# EAGLE design rf exca (EAGLE 9.0.1)
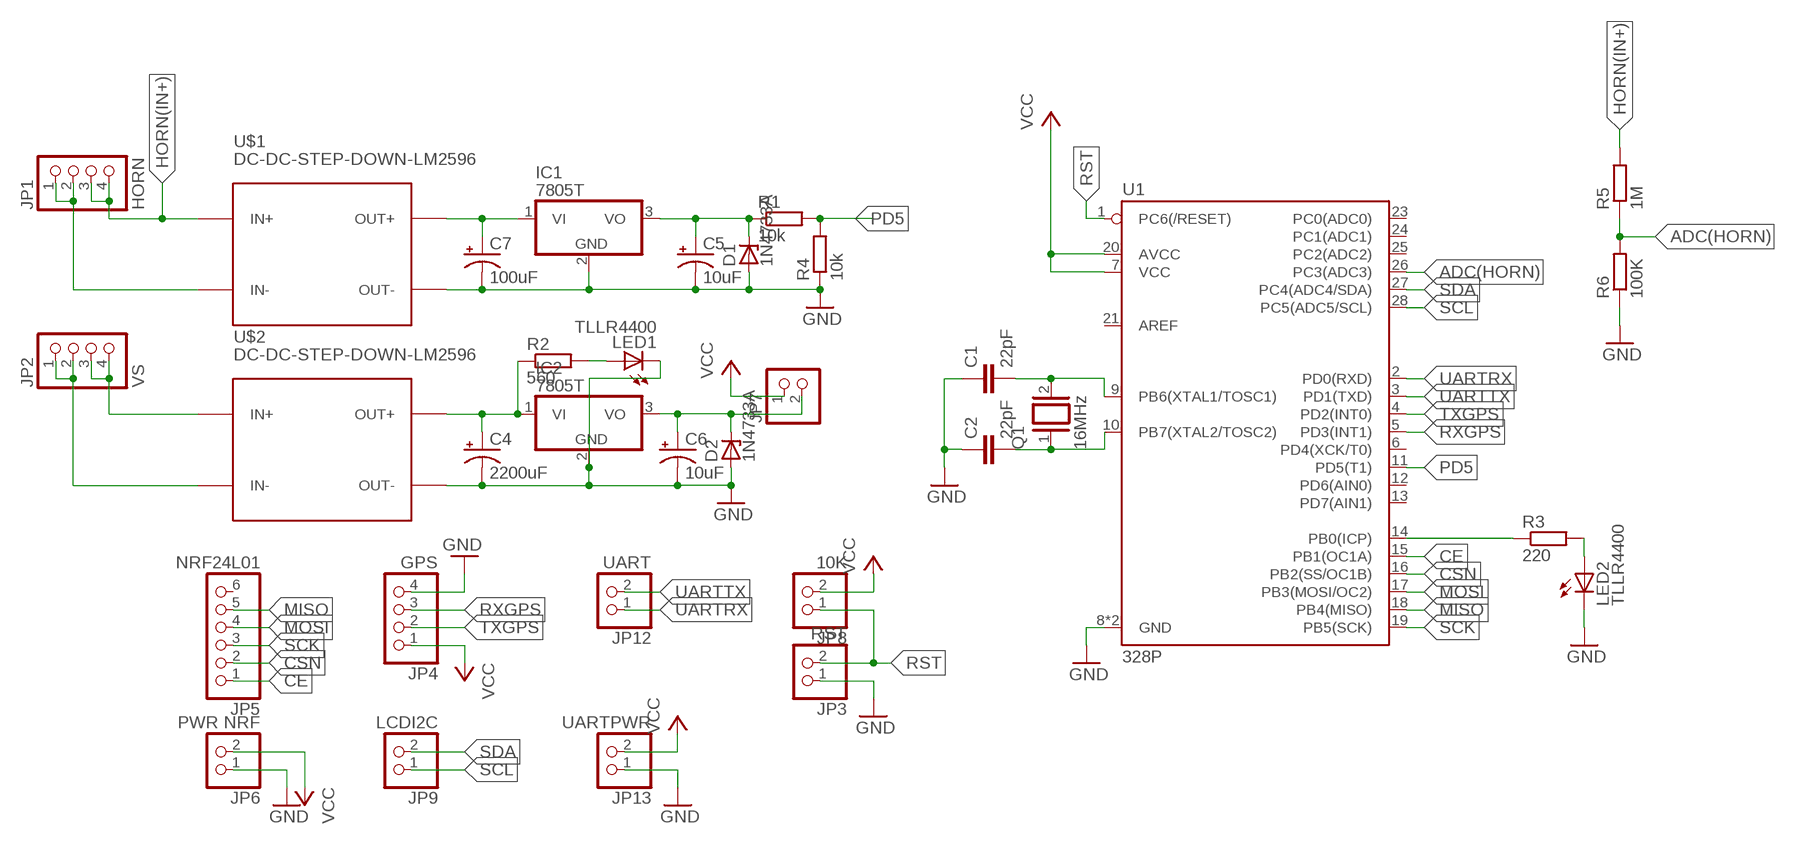
[diagram p0: schematic, sheet 1]

## Parts
C1  22pF  C-EU025-024X044  [C025-024X044]
C2  22pF  C-EU025-024X044  [C025-024X044]
C4  2200uF  CPOL-USE5-13  [E5-13]
C5  10uF  CPOL-USE2,5-6E  [E2,5-6E]
C6  10uF  CPOL-USE2,5-6E  [E2,5-6E]
C7  100uF  CPOL-USE2.5-7  [E2,5-7]
D1  1N4733A  1N4728  [DO41Z10]
D2  1N4733A  1N4728  [DO41Z10]
IC1  7805T  [TO220H]
IC2  7805T  [TO220H]
JP1  HORN  PINHD-1X4  [1X04]
JP2  VS  PINHD-1X4  [1X04]
JP3  RST  PINHD-1X2  [1X02]
JP4  GPS  PINHD-1X4  [1X04]
JP5  NRF24L01  PINHD-1X6  [1X06]
JP6  PWR NRF  PINHD-1X2  [1X02]
JP7  PINHD-1X2  [1X02]
JP8  10K  PINHD-1X2  [1X02]
JP9  LCDI2C  PINHD-1X2  [1X02]
JP12  UART  PINHD-1X2  [1X02]
JP13  UARTPWR  PINHD-1X2  [1X02]
LED1  TLLR4400  [LED3MM]
LED2  TLLR4400  [LED3MM]
Q1  16MHz  XTAL/S  [QS]
R1  10k  R-EU_0207/12  [0207/12]
R2  560  R-EU_0207/12  [0207/12]
R3  220  R-EU_0207/12  [0207/12]
R4  10k  R-EU_0207/12  [0207/12]
R5  1M  R-EU_0207/12  [0207/12]
R6  100K  R-EU_0207/12  [0207/12]
U1  328P  ATMEGA328P_PDIP  [DIP28]
U$1  DC-DC-STEP-DOWN-LM2596  [DC-DC-STEP-DOWN-LM2596]
U$2  DC-DC-STEP-DOWN-LM2596  [DC-DC-STEP-DOWN-LM2596]

## Nets
ADC(HORN): R5.1 R6.2 U1.26(PC3(ADC3))
CE: JP5.1 U1.15(PB1(OC1A))
CSN: JP5.2 U1.16(PB2(SS/OC1B))
GND: C1.1 C2.1 C4.- C5.- C6.- C7.- D1.A D2.A IC1.2(GND) IC2.2(GND) JP3.1 JP4.4 JP6.1 JP13.1 LED1.K(C) LED2.K(C) R4.1 R6.1 U1.8(GND) U1.22(GND) U$1.OUT- U$2.OUT-
HORN(IN+): JP1.3 JP1.4 R5.2 U$1.IN+
MISO: JP5.5 U1.18(PB4(MISO))
MOSI: JP5.4 U1.17(PB3(MOSI/OC2))
N$1: C1.2 Q1.2 U1.9(PB6(XTAL1/TOSC1))
N$2: C2.2 Q1.1 U1.10(PB7(XTAL2/TOSC2))
N$4: JP1.1 JP1.2 U$1.IN-
N$5: JP2.3 JP2.4 U$2.IN+
N$6: JP2.1 JP2.2 U$2.IN-
N$8: LED2.A R3.2
N$9: LED1.A R2.2
N$10: C7.+ IC1.1(VI) U$1.OUT+
N$11: C6.+ D2.C IC2.3(VO) JP7.2
N$12: C5.+ D1.C IC1.3(VO) R1.1
N$14: R3.1 U1.14(PB0(ICP))
N$15: C4.+ IC2.1(VI) R2.1 U$2.OUT+
PD5: R1.2 R4.2 U1.11(PD5(T1))
RST: JP3.2 JP8.1 U1.1(PC6(/RESET))
RXGPS: JP4.3 U1.5(PD3(INT1))
SCK: JP5.3 U1.19(PB5(SCK))
SCL: JP9.1 U1.28(PC5(ADC5/SCL))
SDA: JP9.2 U1.27(PC4(ADC4/SDA))
TXGPS: JP4.2 U1.4(PD2(INT0))
UARTRX: JP12.1 U1.2(PD0(RXD))
UARTTX: JP12.2 U1.3(PD1(TXD))
VCC: JP4.1 JP6.2 JP7.1 JP8.2 JP13.2 U1.7(VCC) U1.20(AVCC)
Unconnected: JP5.6 U1.6(PD4(XCK/T0)) U1.12(PD6(AIN0)) U1.13(PD7(AIN1)) U1.21(AREF) U1.23(PC0(ADC0)) U1.24(PC1(ADC1)) U1.25(PC2(ADC2))

## Library data of the parts
C1 C2 = rcl:C-EU: CAPACITOR, European symbol; SPICEPREFIX: C
C4-C7 = rcl:CPOL-US: POLARIZED CAPACITOR, American symbol; SPICEPREFIX: C
D1 D2 = diode:1N4728: Z DIODE 3.3 V, 1W, 5 percent
IC1 IC2 = linear:78*: Positive VOLTAGE REGULATOR Source: http://cache.national.com/ds/LM/LM78L05.pdf http://www.fairchildsemi.com/ds/LM/LM7805.pdf
JP1 JP2 JP4 = pinhead:PINHD-1X4: PIN HEADER
JP3 JP6-JP9 JP12 JP13 = pinhead:PINHD-1X2: PIN HEADER
JP5 = pinhead:PINHD-1X6: PIN HEADER
LED1 LED2 = led:TLLR4400: Low Current (2mA) LED 3 mm Tinted Diffused Package color RED Source: Data sheet <http://www.farnell.com/datasheets/391100.pdf>; MF: VISHAY SEMICONDUCTOR; OC_FARNELL: 1612437
Q1 = special:XTAL/S: CRYSTAL
R1-R6 = rcl:R-EU_: RESISTOR, European symbol; SPICEPREFIX: R
U1 = SparkFun-IC-Microcontroller:ATMEGA328P_PDIP: Atmel 328P Through hole ATMEGA328P uC used in the Arduino 32kb flash, 1k EEPROM, 2k SRAM Datasheet <http://www.sparkfun.com/datasheets/Components/SMD/ATMega328.pdf> SparkFun Products Storefront component: AVR 28 Pin 20MHz 32K 6A/D - ATMega328P <https://www.sparkfun.com/products/9061> (COM-09061) SparkFun Simon Says - Through-Hole Soldering Kit <https://www.sparkfun.com/products/10547> (KIT-10547) SparkFun Learn to Solder - Simon Says <https://www.sparkfun.com/products/13708> (KIT-13708) SparkFun BigTime Watch Kit <https://www.sparkfun.com/products/11734> (KIT-11734) SparkFun ClockIt <https://www.sparkfun.com/products/10930> (KIT-10930) SparkFun Serial Enabled LCD Kit <https://www.sparkfun.com/products/10097> (LCD-10097) SparkFun Simon Tilts - Through Hole Soldering Kit <https://www.sparkfun.com/products/12634> (KIT-12634) SparkFun Frequency Counter Kit <https://www.sparkfun.com/products/10140> (KIT-10140) FabFM Radio Kit <https://www.sparkfun.com/products/11043> (KIT-11043) SparkFun Binary Blaster Kit <https://www.sparkfun.com/products/12037> (KIT-12037) SparkFun Metro-Gnome <https://www.sparkfun.com/products/9236> (KIT-09236) ATmega328 with Arduino Optiboot (Uno) <https://www.sparkfun.com/products/10524> (DEV-10524); PROD_ID: IC-09136
U$1 U$2 = diy-modules:DC-DC-STEP-DOWN-LM2596: DC/DC Step-Down Regulator based on LM2596-ADJ chip LM2596 datasheet available here: http://www.ti.com/lit/ds/symlink/lm2596.pdf Click here to find device on ebay.com <http://www.ebay.com/sch/lm2596+power+regulator>

## Board
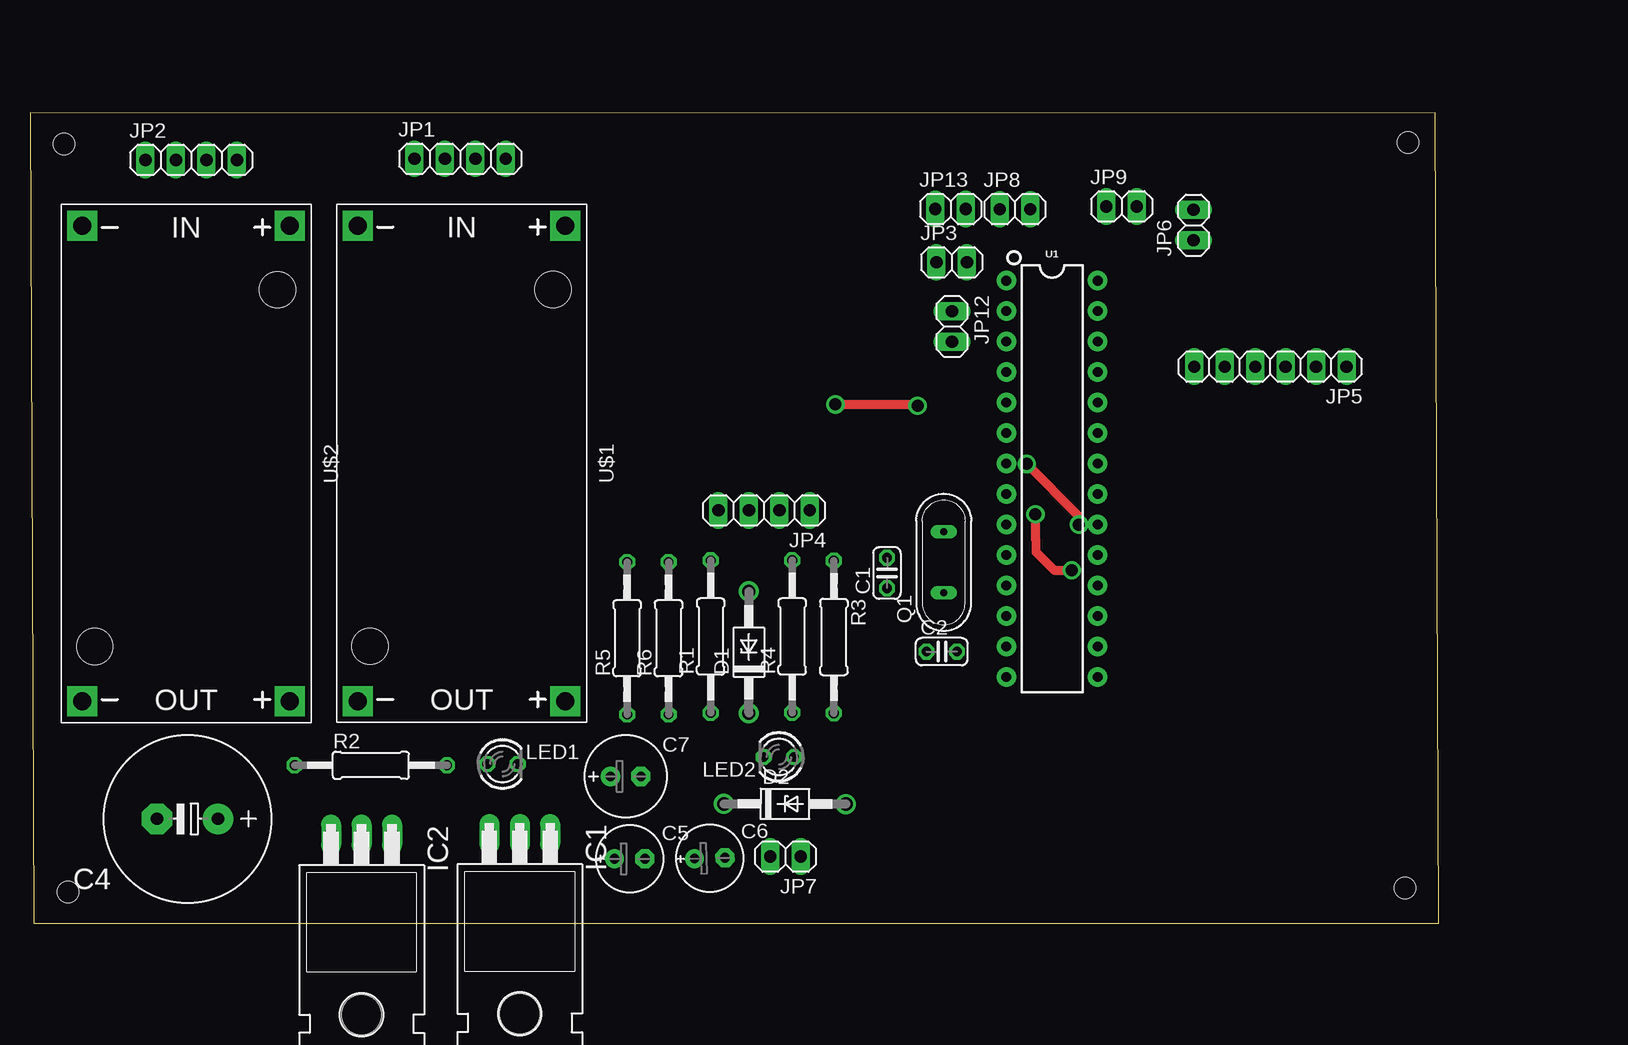
[diagram p1: board, top side]
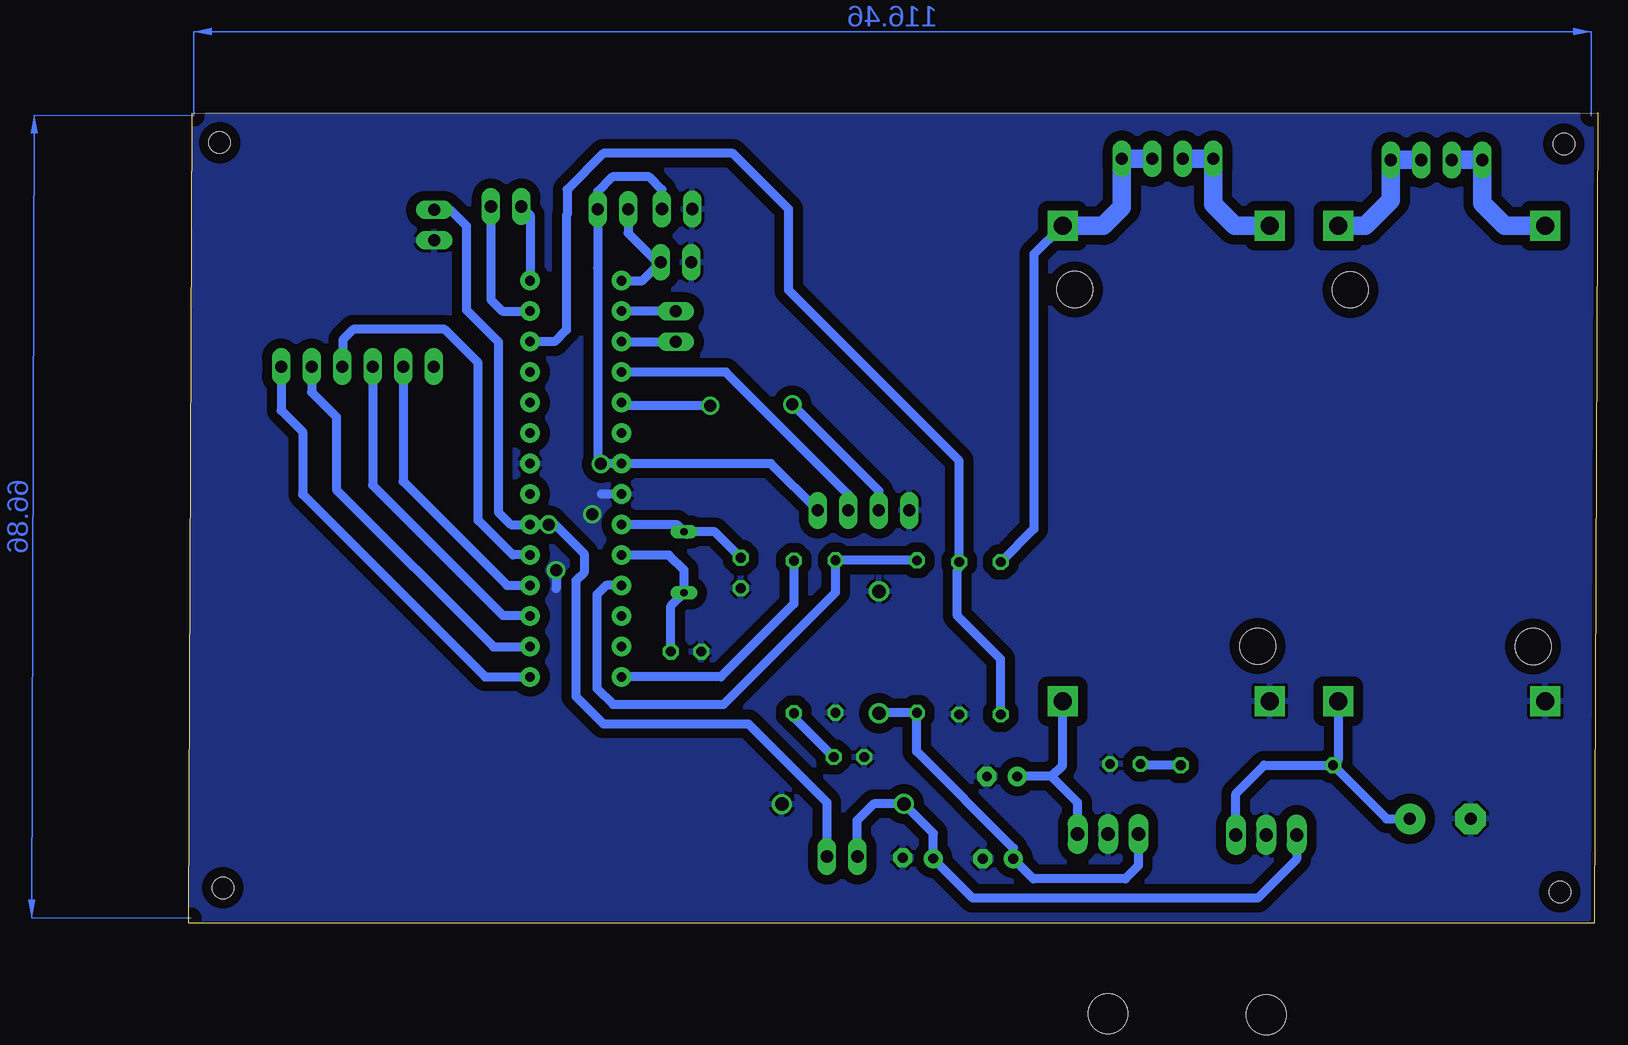
[diagram p2: board, bottom side, seen from below]

Size 117.41 x 67.54 mm. Coordinates in mm from the lower left corner, seen from the top.
Outline: 0.29,0.03 117.41,0 117.12,67.51 0,67.54 0.29,0.03
Copper layers (1*16): Top 0.035mm / dielectric 1.5mm / Bottom 0.035mm
Design rules "default *": minimum track width 30mil, minimum drill 1mm, track to track 8mil, track to pad 8mil, pad to pad 8mil, via to via 8mil, smd to smd 8mil, copper to edge 0mil, drill to drill 6mil, minimum pad ring 10mil, minimum via ring 8mil, stop-mask expansion 4mil, vias tented up to drill 0mil, thermal gap 10mil
Holes 1.78 mm at 3.15,2.63 114.58,2.97 2.82,64.94 114.85,65.06

### Footprints (pad centres in the part's own frame; a part is rotated, then mirrored left to right if it is on the bottom)
C025-024X044 = drill 0.813 octagon: 1 -1.27,0; 2 1.27,0
E5-13 = drill 1.016 pad 2.54: + -2.54,0 | drill 1.016 pad 2.54 octagon: - 2.54,0
E2,5-6E = drill 0.813 pad 1.575: + -1.27,0 | drill 0.813 pad 1.575 octagon: - 1.27,0
E2,5-7 = drill 0.813 pad 1.6: + -1.27,0 | drill 0.813 pad 1.6 octagon: - 1.27,0
DO41Z10 = drill 1.118: A 5.08,0; C -5.08,0
TO220H = drill 1.118 long: 1 -2.54,-10.16; 2 0,-10.16; 3 2.54,-10.16 | hole 3.302: 0,4.826
1X04 = drill 1.016 long: 1 -3.81,0; 2 -1.27,0; 3 1.27,0; 4 3.81,0
1X02 = drill 1.016 long: 1 -1.27,0; 2 1.27,0
1X06 = drill 1.016 long: 1 -6.35,0; 2 -3.81,0; 3 -1.27,0; 4 1.27,0; 5 3.81,0; 6 6.35,0
LED3MM = drill 0.813 octagon: A -1.27,0; K 1.27,0
QS = drill 0.61 long: 1 -2.54,0; 2 2.54,0
0207/12 = drill 0.813 octagon: 1 -6.35,0; 2 6.35,0
DIP28 = drill 0.813 pad 1.626: 1 -16.51,-3.81; 2 -13.97,-3.81; 3 -11.43,-3.81; 4 -8.89,-3.81; 5 -6.35,-3.81; 6 -3.81,-3.81; 7 -1.27,-3.81; 8 1.27,-3.81; 9 3.81,-3.81; 10 6.35,-3.81; 11 8.89,-3.81; 12 11.43,-3.81; 13 13.97,-3.81; 14 16.51,-3.81; 15 16.51,3.81; 16 13.97,3.81; 17 11.43,3.81; 18 8.89,3.81; 19 6.35,3.81; 20 3.81,3.81; 21 1.27,3.81; 22 -1.27,3.81; 23 -3.81,3.81; 24 -6.35,3.81; 25 -8.89,3.81; 26 -11.43,3.81; 27 -13.97,3.81; 28 -16.51,3.81
DC-DC-STEP-DOWN-LM2596 = drill 1.5 pad 2.5 square: IN+ -19.812,8.636; IN- -19.812,-8.636; OUT+ 19.812,8.636; OUT- 19.812,-8.636 | hole 3: -14.478,7.62; 15.24,-7.62

### Placement (x,y rotation side)
C1  71.42,29.2 90 top
C2  75.97,22.65 0 top
C4  13.13,8.72 180 top
C5  49.97,5.38 0 top
C6  56.64,5.44 1.7 top
C7  49.64,12.25 0 top
D1  59.9,22.59 90 top
D2  62.91,9.95 359.9 top
IC1  40.81,-2.7 180 top
IC2  27.63,-2.78 180 top
JP1  35.85,63.72 0 top
JP2  13.43,63.62 0 top
JP3  76.81,55.09 0 top
JP4  61.18,34.41 180 top
JP5  103.36,46.4 180 top
JP6  96.96,58.19 90 top
JP7  62.96,5.57 180 top
JP8  82.08,59.51 0 top
JP9  90.97,59.75 0 top
JP12  76.83,49.73 270 top
JP13  76.72,59.53 0 top
LED1  39.37,13.29 0 top
LED2  62.41,13.86 180 top
Q1  76.14,30.09 90 top
R1  56.73,23.9 90 top
R2  28.4,13.17 0 top
R3  66.99,23.87 270 top
R4  63.52,23.91 90 top
R5  49.76,23.76 90 top
R6  53.22,23.76 90 top
U1  85.17,37.05 270 top
U$1  35.96,38.34 270 top
U$2  13,38.32 270 top

### Tracks (layer width: path | path; a pad name or v marks a point on that pad's centre or on a via)
ADC(HORN)
  Bottom 0.762: R5.1 49.76,22.02 53.37,25.63 53.37,29.47 53.22,29.62 R6.2 53.22,38.55 67.43,52.77 67.43,59.52 72.08,64.17 82.86,64.17 85.88,61.14 85.88,59.07 85.96,58.99 85.96,49.45 86.93,48.48 U1.26
CE
  Bottom 0.762: JP5.1 109.71,42.76 107.93,40.98 107.93,35.76 92.72,20.54 U1.15
CSN
  Bottom 0.762: JP5.2 107.17,44.28 105.11,42.21 105.11,36.15 92.01,23.05 89.01,23.05 U1.16
GND  (via drill 1 pad 1.52)
  Top 0.762: v83.78,34.09 83.78,31.99 83.82,31.96 83.82,30.95 85.34,29.43 v86.81,29.43
  Bottom 0.762: U1.8 83.02,35.78 | v86.81,29.43 86.81,27.89
  pour Bottom (isolate 0.813): 0.54,67.29 117,67.29 116.86,61.46 117.24,0.43 0.78,0.43
HORN(IN+)
  Bottom 0.762: U$1.IN+ 46.99,55.76 46.99,32.88 R5.2
  Bottom 1.524: JP1.3 JP1.4 39.66,59.67 41.21,58.12 44.56,58.12 U$1.IN+
MISO
  Bottom 0.762: JP5.5 99.55,36.83 90.88,28.16 U1.18
MOSI
  Bottom 0.762: JP5.4 102.09,36.52 91.25,25.67 89.03,25.67 U1.17
N$1
  Bottom 0.762: U1.9 76.75,33.24 Q1.2 | 75.91,32.4 Q1.2 | C1.2 73.58,32.63 Q1.2
N$2
  Bottom 0.762: U1.10 81.34,30.69 77.4,30.69 76.14,29.43 Q1.1 77.24,26.45 C2.2
N$4
  Bottom 1.524: JP1.2 JP1.1 32.04,59.93 30.25,58.14 27.34,58.14 U$1.IN-
N$5
  Bottom 1.524: JP2.3 JP2.4 17.24,60.42 17.24,60.26 19.37,58.13 U$2.IN+
N$6
  Bottom 1.524: JP2.2 JP2.1 9.62,60 7.75,58.13 U$2.IN-
N$8
  Bottom 0.762: LED2.A 66.99,17.17 R3.2
N$9
  Bottom 0.762: R2.2 37.99,13.17 LED1.A
N$10
  Bottom 0.762: IC1.1 43.35,10.07 45.53,12.25 | 45.53,12.25 C7.+ | 45.53,12.25 44.6,13.17 U$1.OUT+
N$11
  Bottom 0.762: IC2.3 25.09,5.35 28.34,2.1 52.08,2.1 C6.+ 55.37,7.51 D2.C 60.35,9.96 61.74,8.57 61.74,5.61 JP7.2
N$12
  Bottom 0.762: IC1.3 38.27,4.81 39.37,3.72 47.04,3.72 C5.+ 48.7,6.27 56.76,14.32 56.76,17.51 R1.1 59.86,17.55 D1.C
N$14
  Bottom 0.762: R3.1 66.99,26.63 73.08,20.54 U1.14
N$15
  Bottom 0.762: U$2.OUT+ 21.64,13.59 R2.1 | R2.1 17.6,8.72 C4.+ | IC2.1 30.17,10.81 27.8,13.18 R2.1
PD5
  Bottom 0.762: 63.51,30.25 R4.2 | R1.2 63.51,30.25 | U1.11 82.64,28.16 83.4,27.4 83.4,19.59 82.06,18.24 72.85,18.24 63.51,27.58 63.51,30.25
RST
  Bottom 0.762: U1.1 79.61,53.56 JP3.2 78.37,55.09 80.8,57.52 JP8.1 80.74,58.88
RXGPS  (via drill 1 pad 1.52)
  Top 0.762: v67.11,43.24 73.86,43.24 v73.96,43.13
  Bottom 0.762: JP4.3 59.91,36.04 v67.11,43.24 | v73.96,43.13 81.09,43.13 U1.5
SCK
  Bottom 0.762: U1.19 90.42,30.7 93.3,33.58 93.3,46.71 96.09,49.5 103.7,49.5 104.57,48.63 104.57,46.46 JP5.3
SCL
  Bottom 0.762: JP9.1 88.98,59.03 U1.28
SDA
  Bottom 0.762: JP9.2 92.24,51.99 91.28,51.03 88.99,51.03 U1.27
TXGPS
  Bottom 0.762: JP4.2 62.45,35.74 72.65,45.94 U1.4
UARTRX
  Bottom 0.762: JP12.1 81.34,51 U1.2
UARTTX
  Bottom 0.762: U1.3 76.84,48.48 JP12.2
VCC  (via drill 1 pad 1.52)
  Top 0.762: v83.07,38.29 87.42,33.94 v87.42,33.23
  Bottom 0.762: 83.04,38.32 U1.7 68.9,38.32 JP4.1 | 83.04,38.32 v83.07,38.29 | 88.97,33.23 v87.42,33.23 86.89,33.23 84.47,30.81 84.47,29.24 85.15,28.55 85.15,18.92 82.86,16.63 70.79,16.63 64.24,10.08 JP7.1 | 88.97,33.23 U1.20 | 83.34,54.61 83.34,38.63 83.04,38.32 | 83.34,54.61 JP8.2 83.34,60.98 82.12,62.21 79.05,62.21 77.99,61.15 JP13.2 | 83.34,54.61 | JP6.2 95.64,59.46 94.29,58.12 94.29,51.12 91.63,48.46 91.63,34.27 90.58,33.23 88.97,33.23
(copper drawn outside any net)
  shapes: Bottom area x2